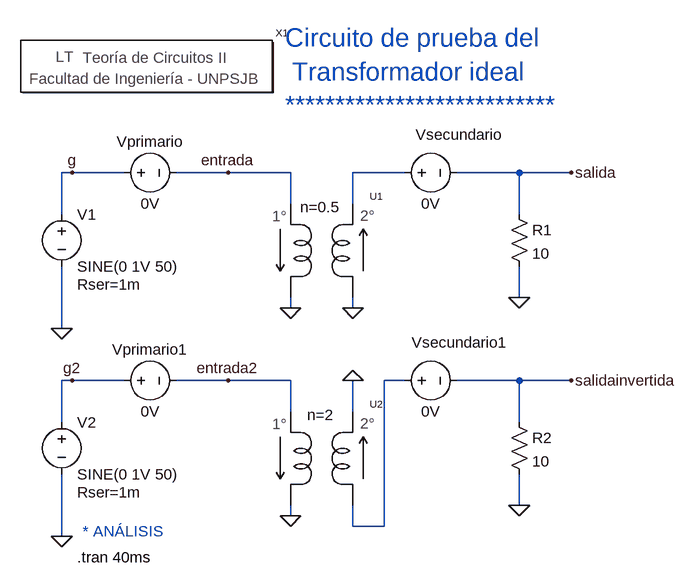
[diagram p0: schematic Circuito de prueba del Transformador ideal.asc]
Circuito de prueba del Transformador ideal.asc, the LTspice schematic file:
Version 4
SHEET 1 964 688
WIRE -224 80 -240 80
WIRE -144 80 -224 80
WIRE 16 80 -64 80
WIRE 112 80 16 80
WIRE 288 80 208 80
WIRE 464 80 368 80
WIRE 544 80 464 80
WIRE 112 128 112 80
WIRE 208 128 208 80
WIRE -240 144 -240 80
WIRE 464 144 464 80
WIRE 464 272 464 224
WIRE 112 288 112 272
WIRE 208 288 208 272
WIRE -240 320 -240 224
WIRE -224 400 -240 400
WIRE -144 400 -224 400
WIRE 16 400 -64 400
WIRE 112 400 16 400
WIRE 288 400 256 400
WIRE 464 400 368 400
WIRE 544 400 464 400
WIRE 112 448 112 400
WIRE 208 448 208 400
WIRE -240 464 -240 400
WIRE 464 464 464 400
WIRE 464 592 464 544
WIRE 112 608 112 592
WIRE 208 624 208 592
WIRE 256 624 256 400
WIRE 256 624 208 624
WIRE -240 640 -240 544
FLAG -240 320 0
FLAG 544 80 salida
FLAG 464 272 0
FLAG 16 80 entrada
FLAG 112 288 0
FLAG -224 80 g
FLAG 208 288 0
FLAG 544 400 salidainvertida
FLAG 464 592 0
FLAG 112 608 0
FLAG 208 400 0
FLAG -240 640 0
FLAG 16 400 entrada2
FLAG -224 400 g2
SYMBOL voltage -240 128 R0
WINDOW 123 0 0 Left 2
WINDOW 39 24 124 Left 2
SYMATTR SpiceLine Rser=1m
SYMATTR InstName V1
SYMATTR Value SINE(0 1V 50)
SYMBOL res 448 128 R0
SYMATTR InstName R1
SYMATTR Value 10
SYMBOL voltage -160 80 M90
WINDOW 0 -32 56 VBottom 2
WINDOW 3 32 56 VTop 2
WINDOW 123 0 0 Left 2
WINDOW 39 0 0 Left 2
SYMATTR InstName Vprimario
SYMATTR Value 0V
SYMBOL voltage 272 80 M90
WINDOW 0 -43 100 VBottom 2
WINDOW 3 32 56 VTop 2
WINDOW 123 0 0 Left 2
WINDOW 39 0 0 Left 2
SYMATTR InstName Vsecundario
SYMATTR Value 0V
SYMBOL res 448 448 R0
SYMATTR InstName R2
SYMATTR Value 10
SYMBOL voltage 272 400 M90
WINDOW 0 -43 100 VBottom 2
WINDOW 3 32 56 VTop 2
WINDOW 123 0 0 Left 2
WINDOW 39 0 0 Left 2
SYMATTR InstName Vsecundario1
SYMATTR Value 0V
SYMBOL voltage -240 448 R0
WINDOW 123 0 0 Left 2
WINDOW 39 24 124 Left 2
SYMATTR SpiceLine Rser=1m
SYMATTR InstName V2
SYMATTR Value SINE(0 1V 50)
SYMBOL voltage -160 400 M90
WINDOW 0 -32 56 VBottom 2
WINDOW 3 32 56 VTop 2
WINDOW 123 0 0 Left 2
WINDOW 39 0 0 Left 2
SYMATTR InstName Vprimario1
SYMATTR Value 0V
SYMBOL trafoi 160 192 R0
SYMATTR SpiceLine n=0.5
SYMATTR InstName U1
SYMBOL trafoi 160 512 R0
SYMATTR SpiceLine n=2
SYMATTR InstName U2
SYMBOL Circuitos2\\Letreros\\Teoría\ de\ Circuitos\ II -112 -80 R0
SYMATTR InstName X1
TEXT 104 -128 Left 4 ;Circuito de prueba del\n Transformador ideal\n***************************
TEXT -216 672 Left 2 !.tran 40ms
TEXT -208 632 Left 2 ;* ANÁLISIS

The netlist it stands for:
* Circuito de prueba del Transformador ideal.asc
V1 g 0 SINE(0 1V 50) Rser=1m
R1 salida 0 10
Vprimario g entrada 0V
Vsecundario N001 salida 0V
R2 salidainvertida 0 10
Vsecundario1 N002 salidainvertida 0V
V2 g2 0 SINE(0 1V 50) Rser=1m
Vprimario1 g2 entrada2 0V
XU1 entrada 0 N001 0 TFI TFI n=0.5  ; pins 1 2 3 4
XU2 entrada2 0 0 N002 TFI TFI n=2  ; pins 1 2 3 4
XX1 Teoría de Circuitos II
* Circuito de prueba del
*  Transformador ideal
* ***************************
.tran 40ms
* * ANÁLISIS
.lib ..\sym\Circuitos2\Transformadores\trafosideales.lib
.backanno
.end